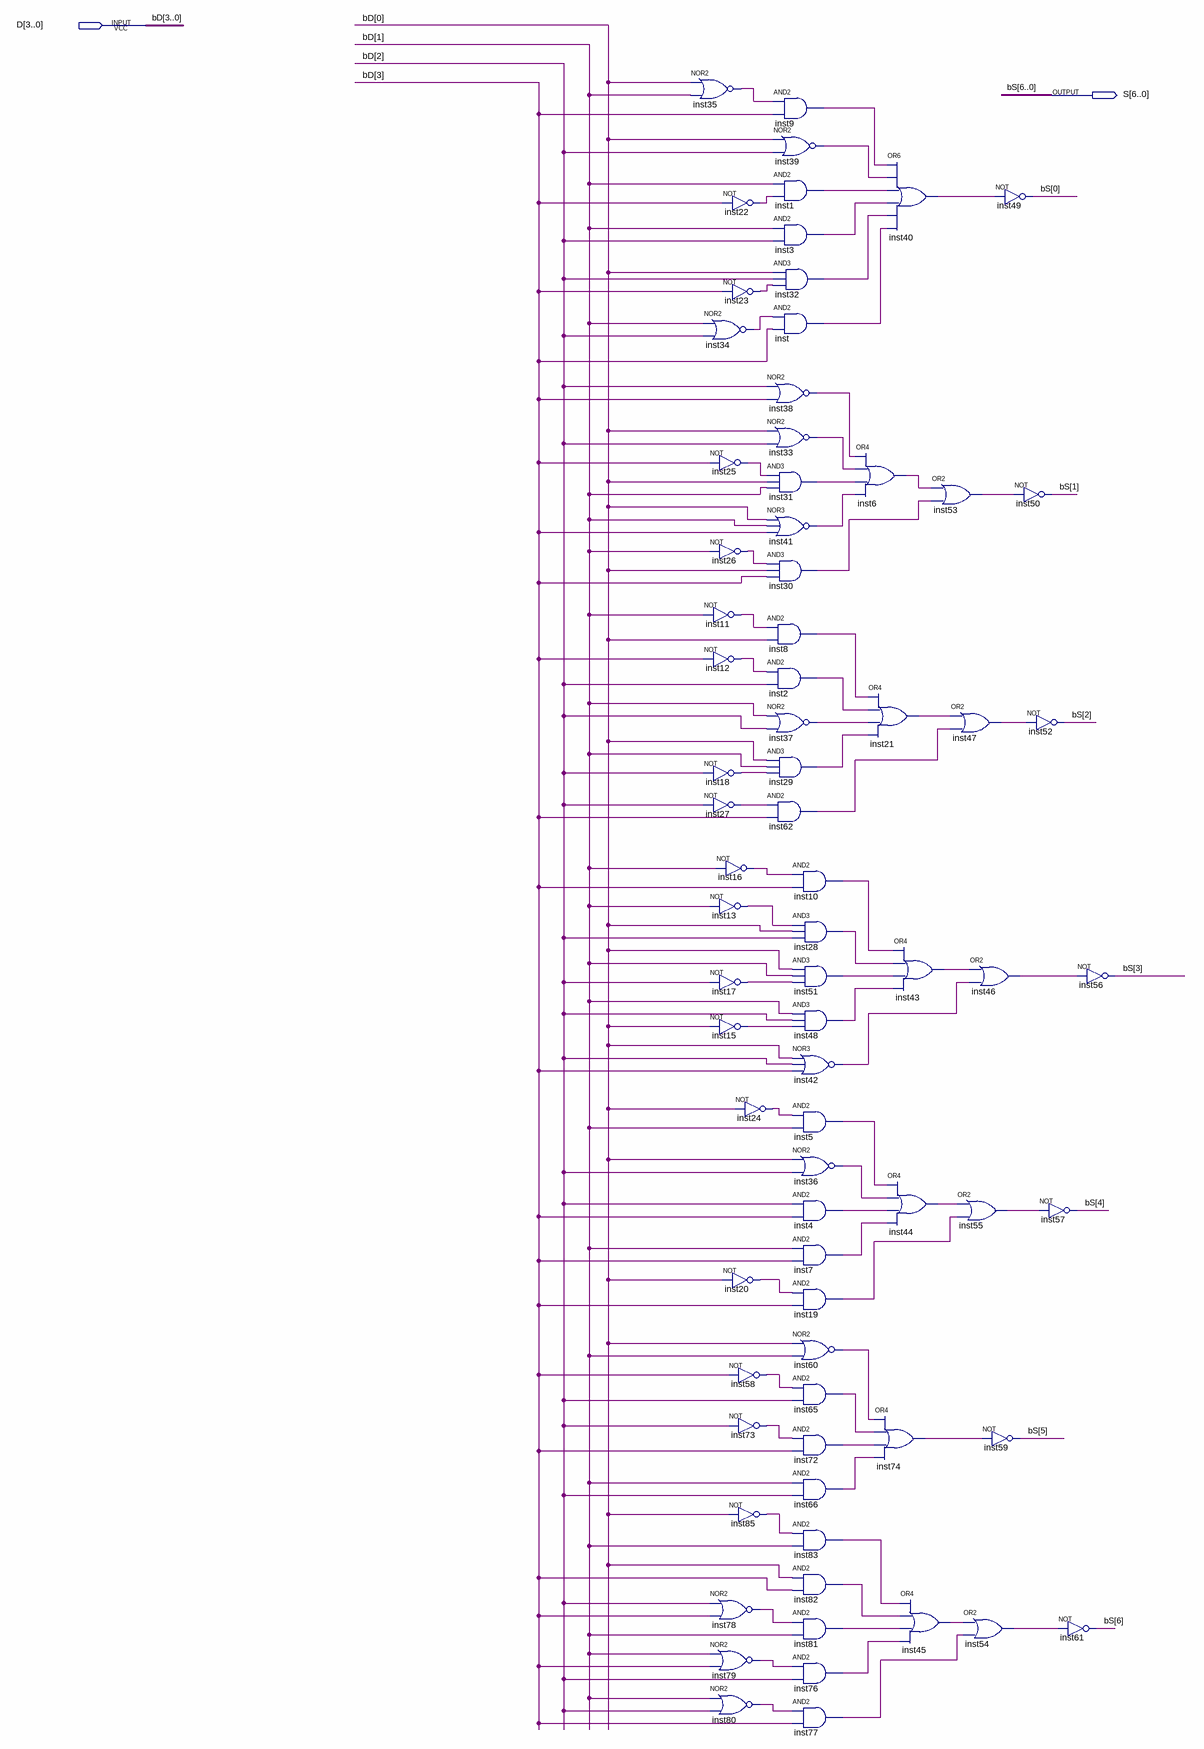
[diagram p0: schematic sheet]
// Quartus schematic display4bits.bdf as structural Verilog: 76 symbols, 2 pins
module display4bits (
  input  [3:0] D,
  output [6:0] S
);

  wire inst1_out, inst2_out, inst3_out, inst4_out, inst5_out, inst6_out, inst7_out, inst8_out, inst9_out,
       inst10_out, inst11_out, inst12_out, inst13_out, inst15_out, inst16_out, inst17_out, inst18_out,
       inst19_out, inst20_out, inst21_out, inst22_out, inst23_out, inst24_out, inst25_out, inst26_out,
       inst27_out, inst28_out, inst29_out, inst30_out, inst31_out, inst32_out, inst33_out, inst34_out,
       inst35_out, inst36_out, inst37_out, inst38_out, inst39_out, inst40_out, inst41_out, inst42_out,
       inst43_out, inst44_out, inst45_out, inst46_out, inst47_out, inst48_out, inst51_out, inst53_out,
       inst54_out, inst55_out, inst58_out, inst60_out, inst62_out, inst65_out, inst66_out, inst72_out,
       inst73_out, inst74_out, inst76_out, inst77_out, inst78_out, inst79_out, inst80_out, inst81_out,
       inst82_out, inst83_out, inst85_out, inst_out;

  nor inst35 (inst35_out, D[0], D[1]);
  nor inst34 (inst34_out, D[1], D[2]);
  not inst25 (inst25_out, D[3]);
  not inst26 (inst26_out, D[1]);
  not inst11 (inst11_out, D[1]);
  not inst12 (inst12_out, D[3]);
  not inst18 (inst18_out, D[2]);
  not inst27 (inst27_out, D[2]);
  not inst16 (inst16_out, D[1]);
  not inst13 (inst13_out, D[1]);
  not inst17 (inst17_out, D[2]);
  not inst15 (inst15_out, D[0]);
  nor inst78 (inst78_out, D[2], D[3]);
  nor inst79 (inst79_out, D[1], D[3]);
  nor inst80 (inst80_out, D[1], D[2]);
  not inst22 (inst22_out, D[3]);
  not inst23 (inst23_out, D[3]);
  nor inst38 (inst38_out, D[2], D[3]);
  nor inst33 (inst33_out, D[0], D[2]);
  and inst31 (inst31_out, inst25_out, D[0], D[1]);
  nor inst41 (inst41_out, D[0], D[1], D[3]);
  and inst30 (inst30_out, inst26_out, D[0], D[3]);
  and inst8 (inst8_out, inst11_out, D[0]);
  and inst2 (inst2_out, inst12_out, D[2]);
  nor inst37 (inst37_out, D[1], D[2]);
  and inst29 (inst29_out, D[0], D[1], inst18_out);
  and inst62 (inst62_out, inst27_out, D[3]);
  not inst24 (inst24_out, D[0]);
  not inst20 (inst20_out, D[0]);
  not inst58 (inst58_out, D[3]);
  not inst73 (inst73_out, D[2]);
  not inst85 (inst85_out, D[0]);
  and inst9 (inst9_out, inst35_out, D[3]);
  nor inst39 (inst39_out, D[0], D[2]);
  and inst1 (inst1_out, D[1], inst22_out);
  and inst3 (inst3_out, D[1], D[2]);
  and inst32 (inst32_out, D[0], D[2], inst23_out);
  and inst (inst_out, inst34_out, D[3]);
  and inst10 (inst10_out, inst16_out, D[3]);
  and inst28 (inst28_out, inst13_out, D[0], D[2]);
  and inst51 (inst51_out, D[0], D[1], inst17_out);
  and inst48 (inst48_out, D[1], D[2], inst15_out);
  nor inst42 (inst42_out, D[0], D[2], D[3]);
  and inst5 (inst5_out, inst24_out, D[1]);
  nor inst36 (inst36_out, D[0], D[2]);
  and inst4 (inst4_out, D[2], D[3]);
  and inst7 (inst7_out, D[1], D[3]);
  and inst19 (inst19_out, inst20_out, D[3]);
  nor inst60 (inst60_out, D[0], D[1]);
  and inst65 (inst65_out, inst58_out, D[2]);
  and inst72 (inst72_out, inst73_out, D[3]);
  and inst66 (inst66_out, D[1], D[2]);
  and inst83 (inst83_out, inst85_out, D[1]);
  and inst82 (inst82_out, D[0], D[3]);
  and inst81 (inst81_out, inst78_out, D[1]);
  and inst76 (inst76_out, inst79_out, D[2]);
  and inst77 (inst77_out, inst80_out, D[3]);
  or inst6 (inst6_out, inst38_out, inst33_out, inst31_out, inst41_out);
  or inst21 (inst21_out, inst8_out, inst2_out, inst37_out, inst29_out);
  or inst40 (inst40_out, inst9_out, inst39_out, inst1_out, inst3_out, inst32_out, inst_out);
  or inst43 (inst43_out, inst10_out, inst28_out, inst51_out, inst48_out);
  or inst44 (inst44_out, inst5_out, inst36_out, inst4_out, inst7_out);
  or inst74 (inst74_out, inst60_out, inst65_out, inst72_out, inst66_out);
  or inst45 (inst45_out, inst83_out, inst82_out, inst81_out, inst76_out);
  or inst53 (inst53_out, inst6_out, inst30_out);
  or inst47 (inst47_out, inst21_out, inst62_out);
  or inst46 (inst46_out, inst43_out, inst42_out);
  or inst55 (inst55_out, inst44_out, inst19_out);
  or inst54 (inst54_out, inst45_out, inst77_out);
  not inst49 (S[0], inst40_out);
  not inst50 (S[1], inst53_out);
  not inst59 (S[5], inst74_out);
  not inst52 (S[2], inst47_out);
  not inst57 (S[4], inst55_out);
  not inst61 (S[6], inst54_out);
  not inst56 (S[3], inst46_out);

  // Other names for the same wires on the sheet: bD[3:0] = D; bS[6:0] = S
endmodule
